# EAGLE design NE555-01 (EAGLE 5.06)
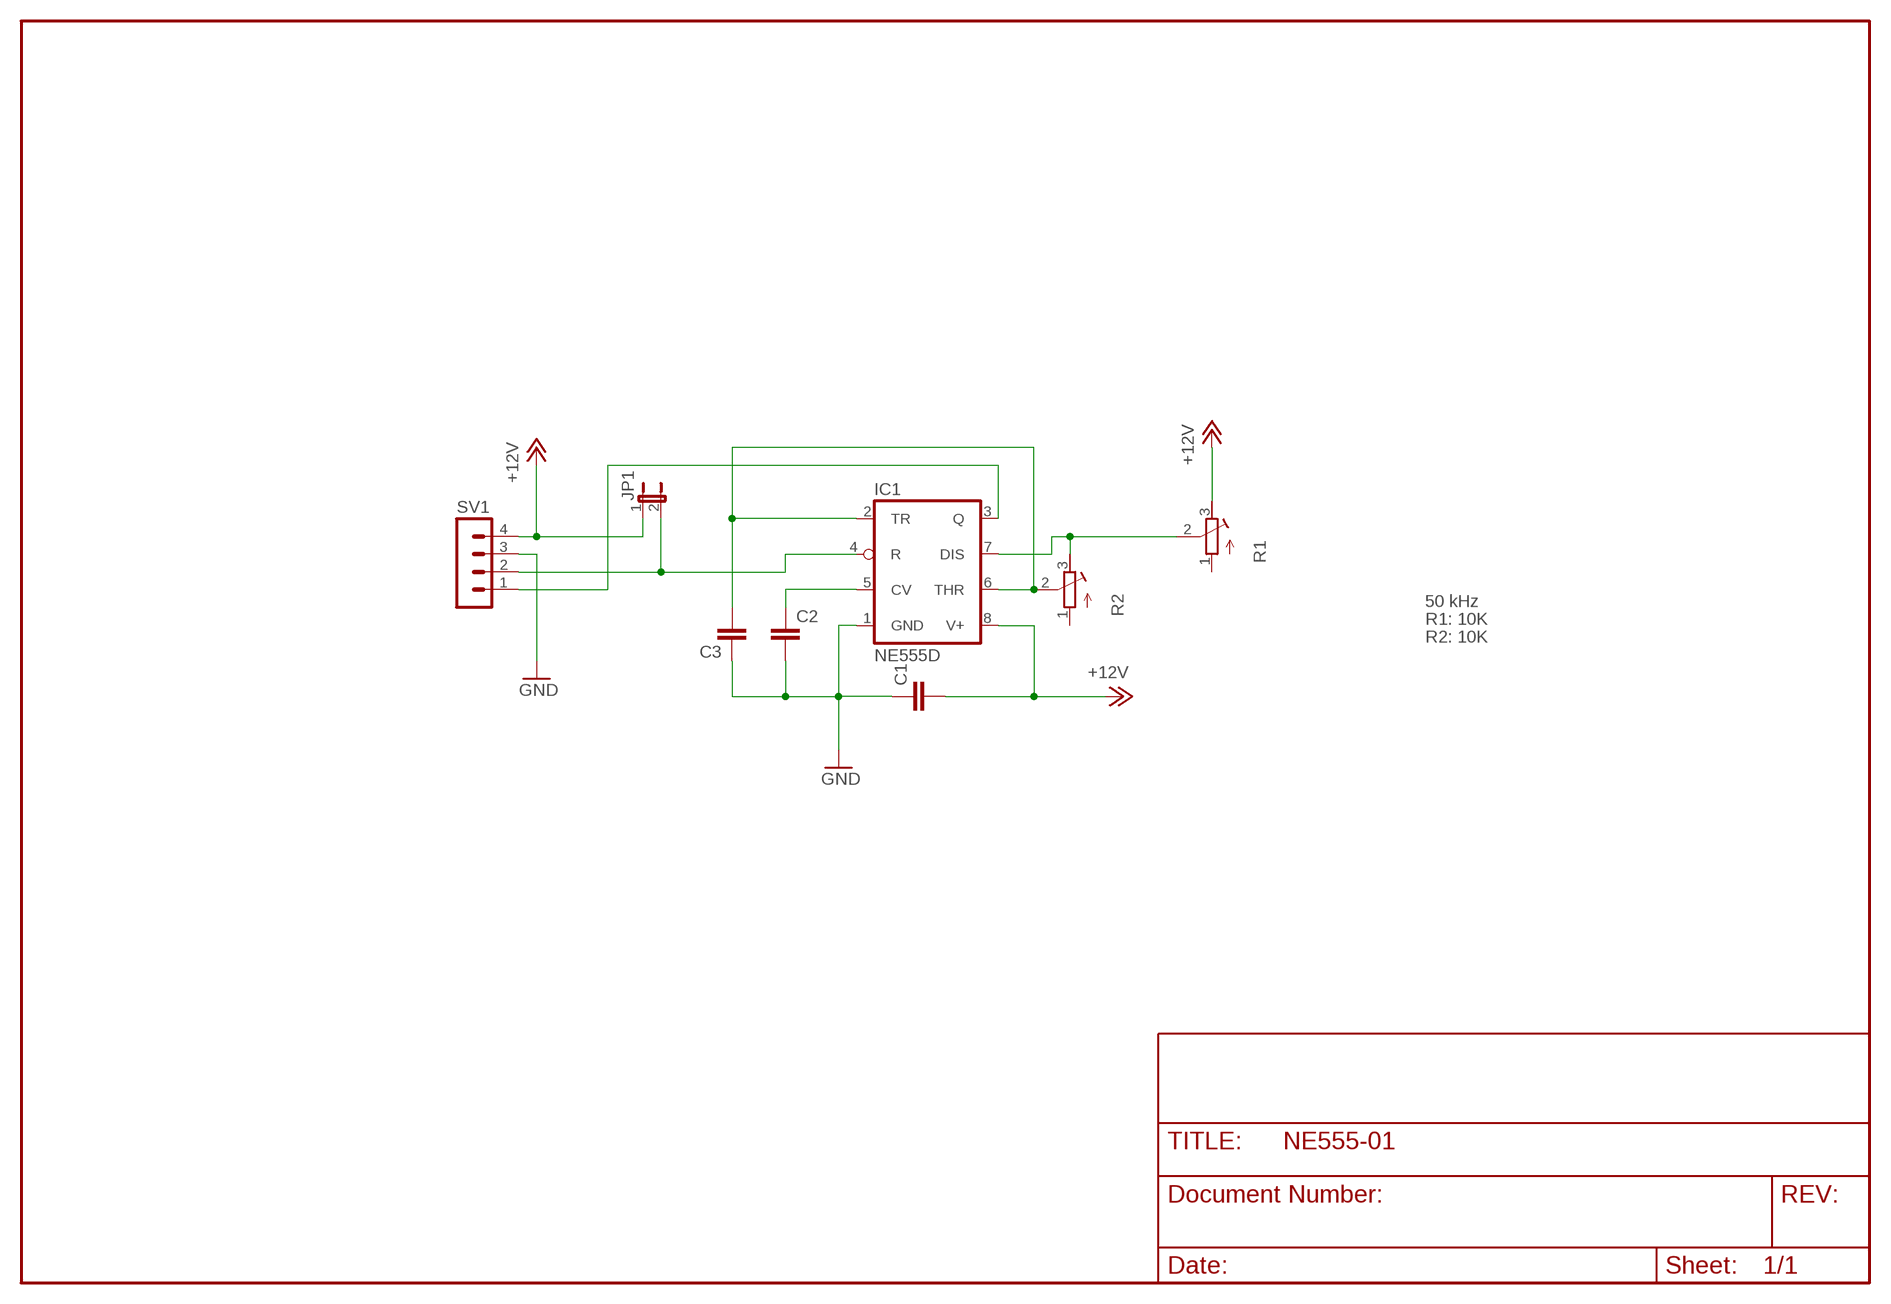
[diagram p0: schematic, sheet 1]

## Parts
C1  C-EUC0805  [C0805]
C2  C-EUC0805  [C0805]
C3  C-EU025_050-025X075  [C025_050-025X075]
IC1  NE555D  [SO08]
JP1  JP1E  [JP1]
R1  R-TRIMM64Y  [RTRIM64Y]
R2  R-TRIMM64Y  [RTRIM64Y]
SV1  MA04-1  [MA04-1]

## Nets
+12V: C1.2 IC1.8(V+) JP1.1 R1.3(A) SV1.4
CV5: C2.1 IC1.5(CV)
DIS7: IC1.7(DIS) R1.2(S) R2.3(A)
GND: C1.1 C2.2 C3.1 IC1.1(GND) SV1.3
N$1: IC1.4(R) JP1.2 SV1.2
Q3: IC1.3(Q) SV1.1
TR2: C3.2 IC1.2(TR) IC1.6(THR) R2.2(S)
Unconnected: R1.1(E) R2.1(E)

## Notes on the sheet
- 50 kHz
- R1: 10K
- R2: 10K

## Library data of the parts
C1 C2 = turbod3:C-EU: CAPACITOR, European symbol
C3 = rcl:C-EU: CAPACITOR, European symbol
IC1 = linear:*555: TIMER
JP1 = jumper:JP1E: JUMPER
R1 R2 = rcl:R-TRIMM: Trimm resistor
SV1 = con-lstb:MA04-1: PIN HEADER

## Board
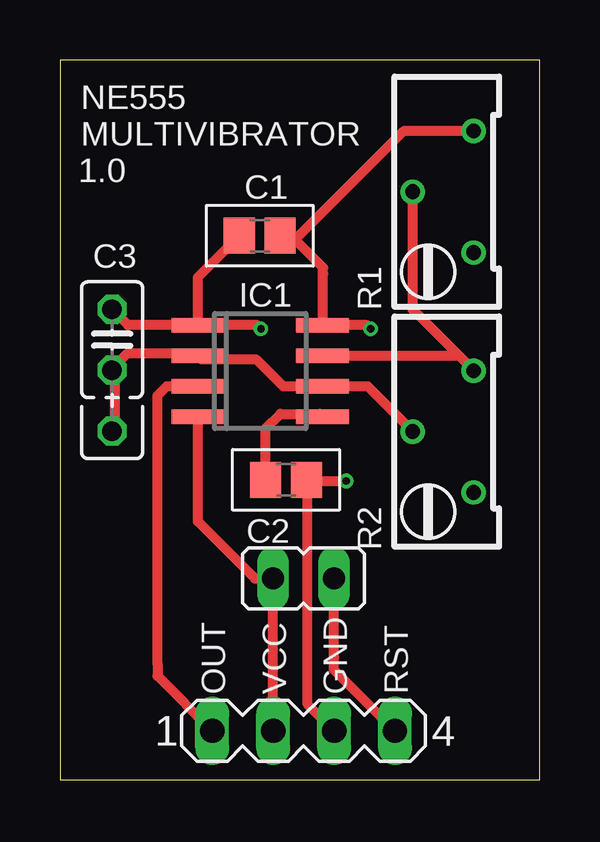
[diagram p1: board, top side]
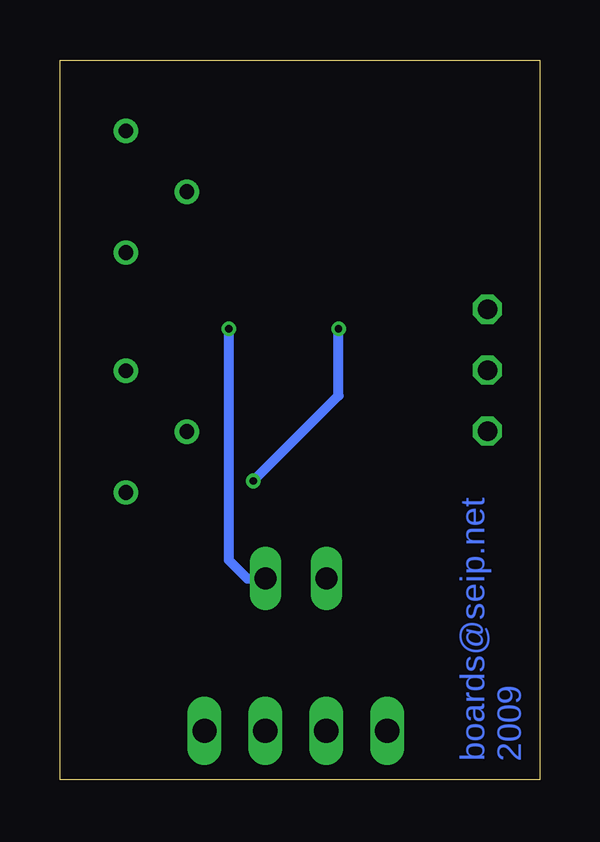
[diagram p2: board, bottom side, seen from below]

Size 20 x 30 mm. Coordinates in mm from the lower left corner, seen from the top.
Outline: 0,0 20,0 20,30 0,30 0,0
Copper layers (1*16): Top 0.035mm / dielectric 1.5mm / Bottom 0.035mm
Design rules "PCB-POOL": minimum track width 6mil, minimum drill 12mil, track to track 6mil, track to pad 6mil, pad to pad 6mil, via to via 6mil, smd to smd 6mil, copper to edge 20mil, drill to drill 8mil, minimum pad ring 8mil, minimum via ring 6mil, stop-mask expansion 3mil, vias tented up to drill 0mil, thermal gap 8mil

### Footprints (pad centres in the part's own frame; a part is rotated, then mirrored left to right if it is on the bottom)
C0805 = smd 1.3 x 1.5: 1 -0.85,0; 2 0.85,0
C025_050-025X075 = drill 0.813 octagon: 1 -1.27,0; 2 1.27,0; 3 3.81,0
SO08 = smd 0.6 x 2.2: 1 -1.905,-2.6; 2 -0.635,-2.6; 3 0.635,-2.6; 4 1.905,-2.6; 5 1.905,2.6; 6 0.635,2.6; 7 -0.635,2.6; 8 -1.905,2.6
JP1 = drill 0.914 long: 1 0,-1.27; 2 0,1.27
RTRIM64Y = drill 0.61 round: 1 0,-2.54; 2 -2.54,0; 3 0,2.54
MA04-1 = drill 1.016 long: 1 -3.81,0; 2 -1.27,0; 3 1.27,0; 4 3.81,0

### Placement (x,y rotation side)
C1  8.33,22.67 0 top
C2  9.43,12.49 0 top
C3  2.17,18.34 270 top
IC1  8.35,17.03 270 top
JP1  10.16,8.38 90 top
R1  17.25,24.51 0 top
R2  17.25,14.51 0 top
SV1  10.16,2.03 0 top

### Tracks (layer width: path | path; a pad name or v marks a point on that pad's centre or on a via)
+12V  (via drill 0.3)
  Top 0.406: C1.2 9.63,22.67 9.8,22.5 | 9.8,22.5 10.97,21.34 10.97,21.08 10.97,18.96 IC1.8 12.81,18.94 v12.95,18.8 | JP1.1 11.43,5.08 11.43,4.57 SV1.4 | R1.3 14.35,27.05 9.8,22.5
  Bottom 0.406: v12.95,18.8 12.95,9.14 12.19,8.38 JP1.1
CV5
  Top 0.406: C2.1 8.58,14.63 9.19,15.24 10.84,15.24 IC1.5
DIS7
  Top 0.406: IC1.7 16.63,17.67 | 16.63,17.67 R2.3 | R1.2 14.71,19.59 16.63,17.67
GND  (via drill 0.3)
  Top 0.406: C1.1 5.75,20.94 IC1.1 | IC1.1 2.84,18.94 C3.1 | C2.2 10.33,12.45 10.33,11.94 | IC1.1 8.24,18.94 v8.38,18.8 | v11.94,12.45 10.83,12.45 10.33,11.94 | 10.33,11.94 10.33,3.14 SV1.3
  Bottom 0.406: v8.38,18.8 8.38,16 v11.94,12.45
N$1
  Top 0.406: IC1.4 5.75,10.76 8.13,8.38 JP1.2 SV1.2
N$2
  Top 0.406: 2.06,17.02 2.29,17.02 | 2.29,17.02 2.32,17.02 | 2.29,17.02 2.29,14.73 2.03,14.48
Q3
  Top 0.406: IC1.3 4.46,16.4 4.06,16 4.06,4.83 4.06,4.32 SV1.1
TR2
  Top 0.406: C3.2 2.17,17.13 2.83,17.78 5.64,17.78 IC1.2 5.89,17.53 8.18,17.53 9.3,16.4 IC1.6 12.82,16.4 R2.2

### Text on the board
Bottom: 2009 | boards@seip.net
tNames: NE555 | MULTIVIBRATOR | 1.0 | OUT | VCC | GND | RST